# Altium schematic sheet MCU.SchDoc
size A; SheetNumber: 2; SheetTotal: 2
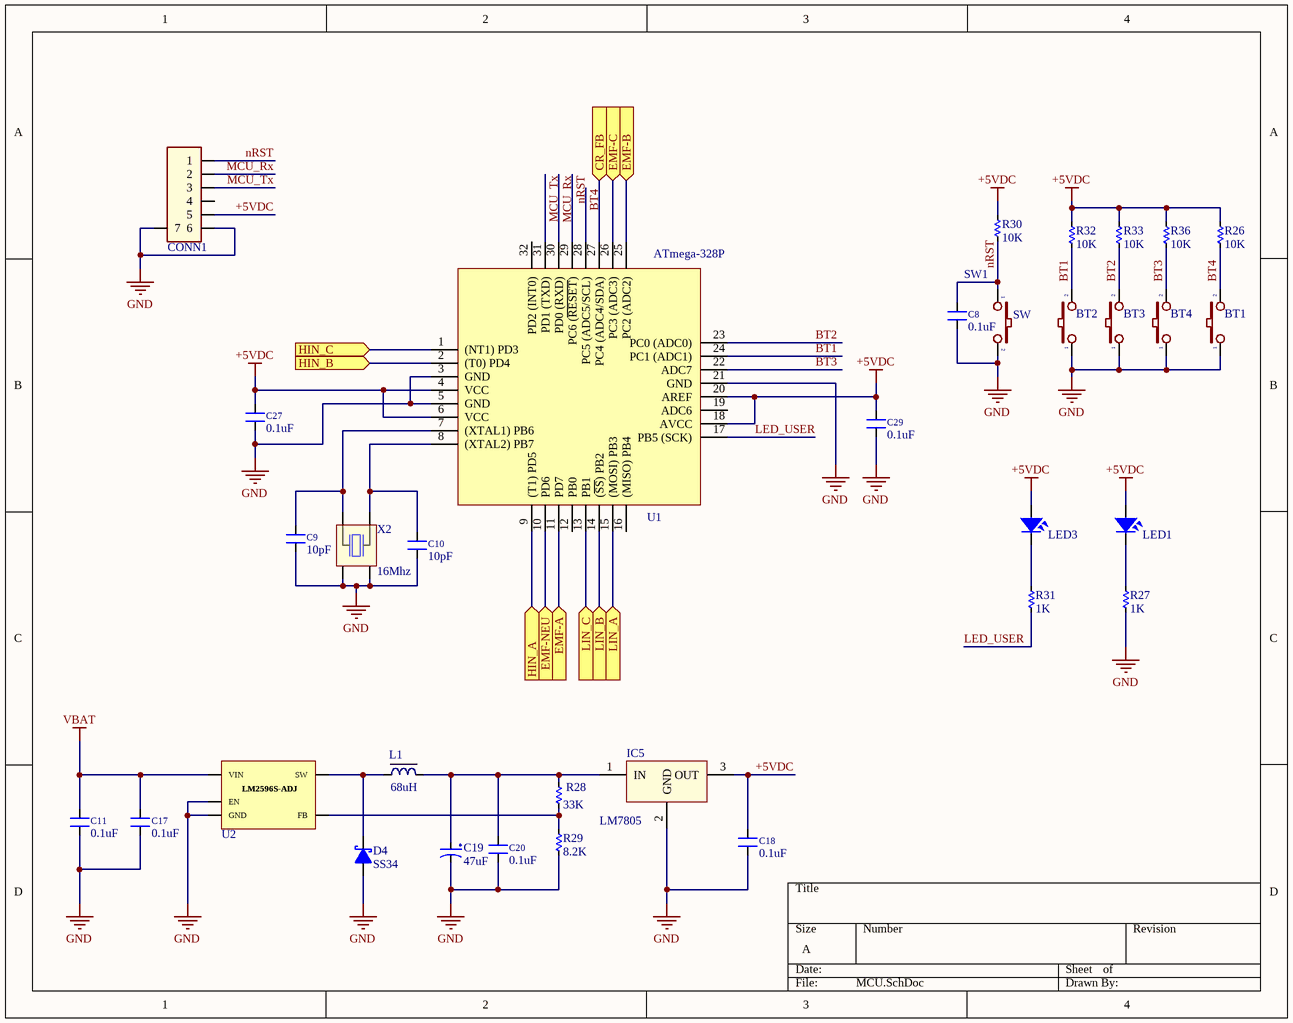
[diagram p0: MCU.SchDoc]

## Parts
BT1  BUTTON1  [SW4_SMD]  (value not drawn)
BT2  BUTTON1  [SW4_SMD]  (value not drawn)
BT3  BUTTON1  [SW4_SMD]  (value not drawn)
BT4  BUTTON1  [SW4_SMD]  (value not drawn)
C8  0.1uF  [CN-SMD-0603]
C9  10pF  [CN-SMD-0805]
C10  10pF  [CN-SMD-0805]
C11  0.1uF  [CN-SMD-1206]
C17  0.1uF  [CN-SMD-0805]
C18  0.1uF  [SM-CAP-0603]
C19  47uF  [CAP-ALU-SMD-6.3x7.7x2.2]
C20  0.1uF  [SM-CAP-0603]
C27  0.1uF  [SM-CAP-0603]
C29  0.1uF  [CN-SMD-0603]
CONN1  CONNECTOR 6P  [JST-PH2.0_6P]  (value not drawn)
D4  SS34  [DO-214AC(SMA)]
IC5  LM7805  [TO263-DDPAK]
L1  68uH  [L-SMD-CDRH127-M-12x7]
LED1  LED SMD  [SM-LED-0603]  (value not drawn)
LED3  LED SMD  [SM-LED-0603]  (value not drawn)
R26  10K  [RES-SMD-0603]
R27  1K  [RES-SMD-0603]
R28  33K  [RES-SMD-0805]
R29  8.2K  [RES-SMD-0805]
R30  10K  [RES-SMD-0603]
R31  1K  [RES-SMD-0603]
R32  10K  [RES-SMD-0603]
R33  10K  [RES-SMD-0603]
R36  10K  [RES-SMD-0603]
SW1  SW  [SW-SMD - 3x4]
U1  ATmega-328P  [TQFP32]
U2  LM2596S  [TO-263_5P]  (value not drawn)
X2  16Mhz  [XT4 SMD 3225]

## Ports
CR_FB (in), EMF-A (in), EMF-B (in), EMF-C (in), EMF-NEU (in), HIN_A (in), HIN_B (in), HIN_C (in), LIN_A (in), LIN_B (in), LIN_C (in)

## Nets
+5VDC: C18.2 C27.2 C29.2 CONN1.5 IC5.3(OUT) LED1.1 LED3.1 R26.2 R30.2 R32.2 R33.2 R36.2 U1.4(VCC) U1.6(VCC) U1.18(AVCC) U1.20(AREF)
GND: BT1.1 BT2.1 BT3.1 BT4.1 C8.2 C9.1 C10.1 C11.1 C17.1 C18.1 C19.2 C20.1 C27.1 C29.1 CONN1.6 CONN1.7 D4.A IC5.2(GND) R27.2 R29.2 SW1.2 U1.3(GND) U1.5(GND) U1.21(GND) U2.3(GND) U2.5(EN) X2.2(inp) X2.4(inp)
VBAT: C11.2 C17.2 U2.1(VIN)
BT1: BT2.2 R32.1 U1.24(PC1_(ADC1))
BT2: BT3.2 R33.1 U1.23(PC0_(ADC0))
BT3: BT4.2 R36.1 U1.22(ADC7)
BT4: BT1.2 R26.1 U1.28(PC5_(ADC5/SCL))
CR_FB: U1.27(PC4_(ADC4/SDA)) ; port CR_FB
EMF-A: U1.11(PD7) ; port EMF-A
EMF-B: U1.25(PC2_(ADC2)) ; port EMF-B
EMF-C: U1.26(PC3_(ADC3)) ; port EMF-C
EMF-NEU: U1.10(PD6) ; port EMF-NEU
HIN_A: U1.9((T1)_PD5) ; port HIN_A
HIN_B: U1.2((T0)_PD4) ; port HIN_B
HIN_C: U1.1((NT1)_PD3) ; port HIN_C
LED_USER: R31.2 U1.17(PB5_(SCK))
LIN_A: U1.15((MOSI)_PB3) ; port LIN_A
LIN_B: U1.14((~{SS})_PB2) ; port LIN_B
LIN_C: U1.13(PB1) ; port LIN_C
MCU_Rx: CONN1.2 U1.30(PD0_(RXD))
MCU_Tx: CONN1.3 U1.31(PD1_(TXD))
nRST: C8.1 CONN1.1 R30.1 SW1.1 U1.29(PC6_(~{RESET}))
NetC9_2: C9.2 U1.7((XTAL1)_PB6) X2.3(out)
NetC10_2: C10.2 U1.8((XTAL2)_PB7) X2.1(inp)
NetC19_1: C19.1 C20.2 IC5.1(IN) L1.2 R28.2
NetD4_K: D4.K L1.1 U2.2(SW)
NetLED1_2: LED1.2 R27.1
NetLED3_2: LED3.2 R31.1
NetR28_1: R28.1 R29.1 U2.4(FB)

Not connected (* = marked no-connect by the designer): CONN1 4; U1 12(PB0) 16((MISO)_PB4) 19(ADC6) 32(PD2_(INT0))

## Notes on the sheet
- (in symbol LM2596S) LM2596S-ADJ

## Library data of the parts
BT1-BT4 = BUTTON1: Value: 1N4007
C8-C11 C17 C18 C20 C27 C29 = CAP SMD: Value: 0,1uF/300V; Designed by: VanDungEvn
C19 = CAP-ALU-SMD: Published: 8-Jun-2000; LatestRevisionDate: 17-Jul-2002; LatestRevisionNote: Re-released for DXP Platform.; PackageReference: POLAR0.8; Publisher: Altium Limited
D4 = Diode  Schottky: pin to pad: A>1 K>2; Value: 1N4007
IC5 = LM78xx: On ap +, from + 5 to + 24VDC; Value: LM7805
L1 = inductor-SMD: Value: 150 mH
LED1 LED3 = LED-SMD-0805
R26-R33 R36 = Res-SMD: Resistor; Manufacturer: Generic Components; Class: Passive; Published: 08/06/2000; Publisher: Altium Hobart Technology Centre
SW1 = SW2: Switch button 2 pin; Value: SW chip 2 pin
U1 = Atmega328P-SMD: Atmega328psmd
X2 = XTAL SMD 4PIN: XTAL SMD 3225, 12MHz, Cl=18pF, Tol: ±30ppm, Stab: ±30ppm